# Altium schematic sheet Sheet1.SchDoc
size A4; SheetNumber: 1; SheetTotal: 1
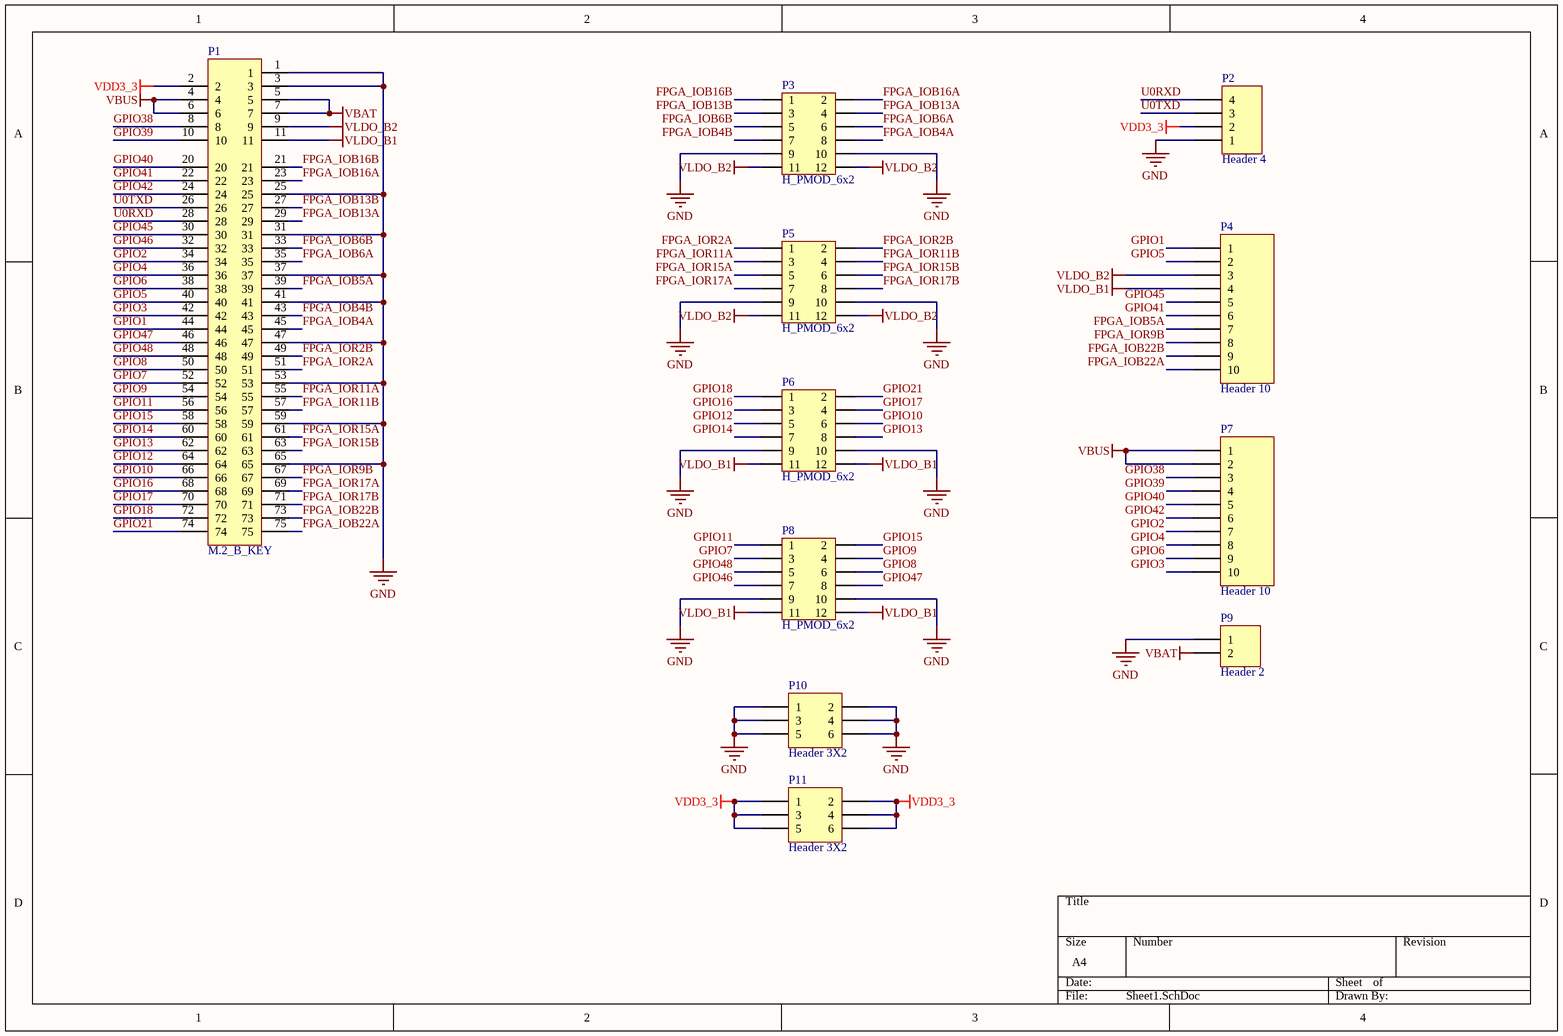
[diagram p0: Sheet1.SchDoc]

## Parts
P1  M.2_B_KEY  [M.2 B KEY M]
P2  Header 4  [H-Header_4P-1.0mm]
P3  H_PMOD_6x2  [PMOD 6x2]
P4  Header 10  [10P_HDR]
P5  H_PMOD_6x2  [PMOD 6x2]
P6  H_PMOD_6x2  [PMOD 6x2]
P7  Header 10  [10P_HDR]
P8  H_PMOD_6x2  [PMOD 6x2]
P9  Header 2  [BAT电池盒]
P10  Header 3X2  [HDR_3x2]
P11  Header 3X2  [HDR_3x2]

## Nets
GND: P1.1 P1.3 P1.25 P1.31 P1.37 P1.41 P1.47 P1.53 P1.59 P1.65 P2.1 P3.9 P3.10 P5.9 P5.10 P6.9 P6.10 P8.9 P8.10 P9.1 P10.1 P10.2 P10.3 P10.4 P10.5 P10.6
VBAT: P1.5 P1.7 P9.2
VBUS: P1.4 P1.6 P7.1 P7.2
VDD3_3: P1.2 P2.2 P11.1 P11.2 P11.3 P11.4 P11.5 P11.6
VLDO_B1: P1.11 P4.4 P6.11 P6.12 P8.11 P8.12
VLDO_B2: P1.9 P3.11 P3.12 P4.3 P5.11 P5.12
FPGA_IOB4A: P1.45 P3.8
FPGA_IOB4B: P1.43 P3.7
FPGA_IOB5A: P1.39 P4.7
FPGA_IOB6A: P1.35 P3.6
FPGA_IOB6B: P1.33 P3.5
FPGA_IOB13A: P1.29 P3.4
FPGA_IOB13B: P1.27 P3.3
FPGA_IOB16A: P1.23 P3.2
FPGA_IOB16B: P1.21 P3.1
FPGA_IOB22A: P1.75 P4.10
FPGA_IOB22B: P1.73 P4.9
FPGA_IOR2A: P1.51 P5.1
FPGA_IOR2B: P1.49 P5.2
FPGA_IOR9B: P1.67 P4.8
FPGA_IOR11A: P1.55 P5.3
FPGA_IOR11B: P1.57 P5.4
FPGA_IOR15A: P1.61 P5.5
FPGA_IOR15B: P1.63 P5.6
FPGA_IOR17A: P1.69 P5.7
FPGA_IOR17B: P1.71 P5.8
GPIO1: P1.44 P4.1
GPIO2: P1.34 P7.7
GPIO3: P1.42 P7.10
GPIO4: P1.36 P7.8
GPIO5: P1.40 P4.2
GPIO6: P1.38 P7.9
GPIO7: P1.52 P8.3
GPIO8: P1.50 P8.6
GPIO9: P1.54 P8.4
GPIO10: P1.66 P6.6
GPIO11: P1.56 P8.1
GPIO12: P1.64 P6.5
GPIO13: P1.62 P6.8
GPIO14: P1.60 P6.7
GPIO15: P1.58 P8.2
GPIO16: P1.68 P6.3
GPIO17: P1.70 P6.4
GPIO18: P1.72 P6.1
GPIO21: P1.74 P6.2
GPIO38: P1.8 P7.3
GPIO39: P1.10 P7.4
GPIO40: P1.20 P7.5
GPIO41: P1.22 P4.6
GPIO42: P1.24 P7.6
GPIO45: P1.30 P4.5
GPIO46: P1.32 P8.7
GPIO47: P1.46 P8.8
GPIO48: P1.48 P8.5
U0RXD: P1.28 P2.4
U0TXD: P1.26 P2.3

## Library data of the parts
P2 = H_Header_4
P4 P7 = H_Header_10
P9 = H_Header_2
P10 P11 = H_Header_3X2